# EAGLE design dc-servo-controller (EAGLE 5.10)
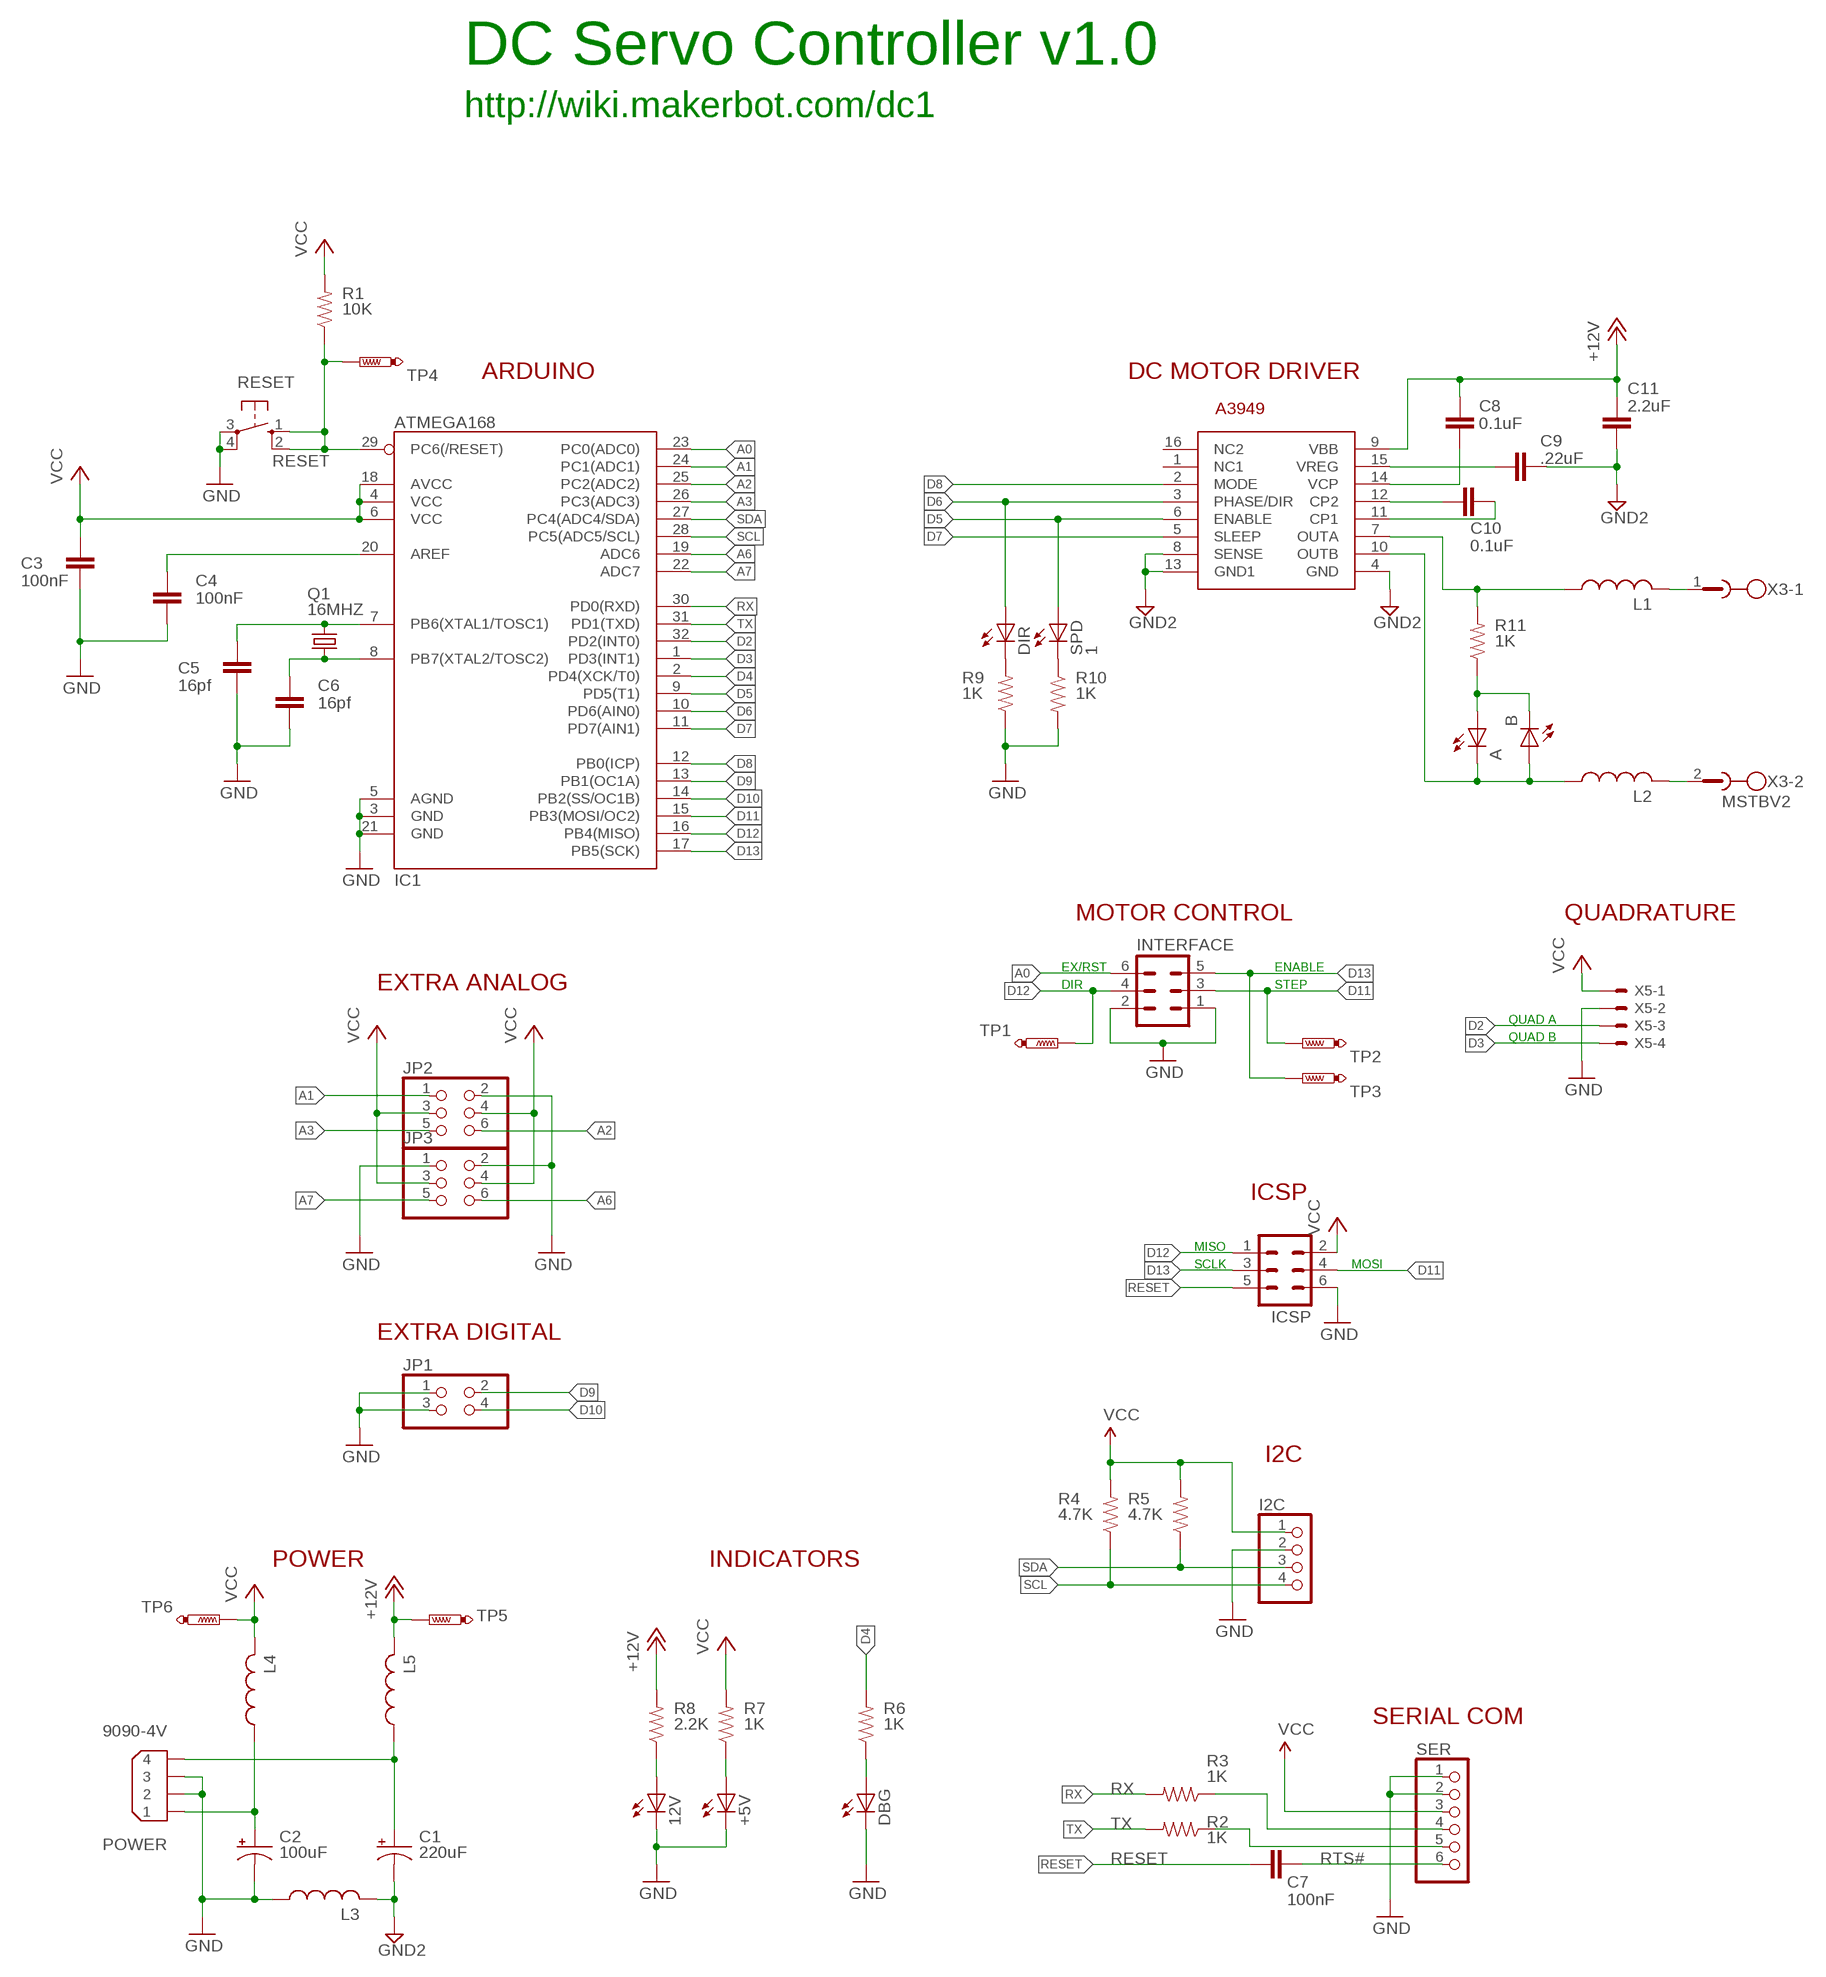
[diagram p0: schematic, sheet 1]

## Parts
12V  LED0805  [LED-0805]
+5V  LED0805  [LED-0805]
A  LED0805  [LED-0805]
B  LED0805  [LED-0805]
C1  220uF  CPOL-USE3.5-8  [E3,5-8]
C2  100uF  CPOL-USE3.5-8  [E3,5-8]
C3  100nF  CAP0805  [0805]
C4  100nF  CAP0805  [0805]
C5  16pf  CAP0805  [0805]
C6  16pf  CAP0805  [0805]
C7  100nF  CAP0805  [0805]
C8  0.1uF  CAP0805  [0805]
C9  .22uF  CAP0805  [0805]
C10  0.1uF  CAP0805  [0805]
C11  2.2uF  CAP0805  [0805]
DBG  LED0805  [LED-0805]
DIR  LED0805  [LED-0805]
I2C  PINHD-1X4  [1X04]
IC1  ATMEGA168  [TQFP32-08]
IC2  A3949  [SO16W]
ICSP  ML6  [ML6]
INTERFACE  ML6  [ML6]
JP1  PINHD-2X2  [2X02]
JP2  PINHD-2X3  [2X03]
JP3  PINHD-2X3  [2X03]
L1  L-USL2012C  [L2012C]
L2  L-USL2012C  [L2012C]
L3  L-USL2012C  [L2012C]
L4  L-USL2012C  [L2012C]
L5  L-USL2012C  [L2012C]
POWER  9090-4V  [9090-4V]
Q1  16MHZ  CRYSTALHC49S  [HC49/S]
R1  10K  RESISTOR  [0805]
R2  1K  RESISTOR  [0805]
R3  1K  RESISTOR  [0805]
R4  4.7K  RESISTOR  [0805]
R5  4.7K  RESISTOR  [0805]
R6  1K  RESISTOR  [0805]
R7  1K  RESISTOR  [0805]
R8  2.2K  RESISTOR  [0805]
R9  1K  RESISTOR  [0805]
R10  1K  RESISTOR  [0805]
R11  1K  RESISTOR  [0805]
RESET  10-XX  [B3F-10XX]
SER  PINHD-1X6  [1X06]
SPD  1  LED0805  [LED-0805]
TP1  PTR1TP09R  [TP09R]
TP2  PTR1TP09R  [TP09R]
TP3  PTR1TP09R  [TP09R]
TP4  PTR1TP09R  [TP09R]
TP5  PTR1TP09R  [TP09R]
TP6  PTR1TP09R  [TP09R]
X3  MSTBV2  [MSTBV2]
X5  C-GRID-04-70543  [70543-04]

## Nets
+12V [Power]: C8.2 C11.2 IC2.9(VBB) L5.2 R8.2 TP5.TP
A0: IC1.23(PC0(ADC0)) INTERFACE.6
A1: IC1.24(PC1(ADC1)) JP2.1
A2: IC1.25(PC2(ADC2)) JP2.6
A3: IC1.26(PC3(ADC3)) JP2.5
A6: IC1.19(ADC6) JP3.6
A7: IC1.22(ADC7) JP3.5
D2: IC1.32(PD2(INT0)) X5.3
D3: IC1.1(PD3(INT1)) X5.4
D4: IC1.2(PD4(XCK/T0)) R6.2
D5: IC1.9(PD5(T1)) IC2.6(ENABLE) SPD.A
D6: DIR.A IC1.10(PD6(AIN0)) IC2.3(PHASE/DIR)
D7: IC1.11(PD7(AIN1)) IC2.5(SLEEP)
D8: IC1.12(PB0(ICP)) IC2.2(MODE)
D9: IC1.13(PB1(OC1A)) JP1.2
D10: IC1.14(PB2(SS/OC1B)) JP1.4
D11: IC1.15(PB3(MOSI/OC2)) ICSP.4 INTERFACE.3 TP2.TP
D12: IC1.16(PB4(MISO)) ICSP.1 INTERFACE.4 TP1.TP
D13: IC1.17(PB5(SCK)) ICSP.3 INTERFACE.5 TP3.TP
GND [Power]: 12V.C +5V.C C2.- C3.1 C4.1 C5.1 C6.1 DBG.C I2C.2 IC1.3(GND) IC1.5(AGND) IC1.21(GND) ICSP.6 INTERFACE.1 INTERFACE.2 JP1.1 JP1.3 JP2.2 JP3.1 JP3.2 L3.1 POWER.2 POWER.3 R9.1 R10.2 RESET.3(P) RESET.4(P1) SER.1 SER.2 X5.2
GND2 [Power]: C1.- C9.1 C11.1 IC2.4(GND) IC2.8(SENSE) IC2.13(GND1) L3.2
N$1: L1.2 X3.1
N$2: +5V.A R7.1
N$3: L2.2 X3.2
N$4: C4.2 IC1.20(AREF)
N$5: R2.1 SER.5
N$6: C9.2 IC2.15(VREG)
N$7: C10.2 IC2.12(CP2)
N$8: R3.1 SER.4
N$9: C10.1 IC2.11(CP1)
N$10: C2.+ L4.1 POWER.1
N$11: DBG.A R6.1
N$12 [Power]: C1.+ L5.1 POWER.4
N$13: IC2.7(OUTA) L1.1 R11.2
N$14: A.C B.A IC2.10(OUTB) L2.1
N$15: A.A B.C R11.1
N$16: C8.1 IC2.14(VCP)
N$18: R10.1 SPD.C
N$23: DIR.C R9.2
N$26: 12V.A R8.1
N$31: C5.2 IC1.7(PB6(XTAL1/TOSC1)) Q1.2
N$32: C6.2 IC1.8(PB7(XTAL2/TOSC2)) Q1.1
RESET: C7.2 IC1.29(PC6(/RESET)) ICSP.5 R1.1 RESET.1(S) RESET.2(S1) TP4.TP
RTS#: C7.1 SER.6
RX: IC1.30(PD0(RXD)) R3.2
SCL: I2C.4 IC1.28(PC5(ADC5/SCL)) R4.1
SDA: I2C.3 IC1.27(PC4(ADC4/SDA)) R5.1
TX: IC1.31(PD1(TXD)) R2.2
VCC: C3.2 I2C.1 IC1.4(VCC) IC1.6(VCC) IC1.18(AVCC) ICSP.2 JP2.3 JP2.4 JP3.3 JP3.4 L4.2 R1.2 R4.2 R5.2 R7.2 SER.3 TP6.TP X5.1
Unconnected: IC2.1(NC1) IC2.16(NC2)

## Notes on the sheet
- DC Servo Controller v1.0
- http://wiki.makerbot.com/dc1
- ARDUINO | DC MOTOR DRIVER
- MOTOR CONTROL | QUADRATURE
- EX/RST | ENABLE
- EXTRA ANALOG | DIR | STEP
- QUAD A
- QUAD B
- ICSP
- MISO
- SCLK | MOSI
- EXTRA DIGITAL
- I2C
- POWER | INDICATORS
- SERIAL COM

## Library data of the parts
12V +5V A B DBG DIR SPD = SparkFun:LED: LEDs Standard schematic elements and footprints for 5mm, 3mm, 1206, and 0603 sized LEDs. 5mm - Spark Fun Electronics SKU : COM-00529 (and others)
C1 C2 = rcl:CPOL-US: POLARIZED CAPACITOR, American symbol
C3-C11 = SparkFun:CAP: Capacitor Standard 0603 ceramic capacitor, and 0.1" leaded capacitor.
I2C = pinhead:PINHD-1X4: PIN HEADER
IC1 = SparkFun:ATMEGA168
IC2 = reprap:A3949
ICSP = con-harting-ml:ML6: HARTING
INTERFACE = con-ml:ML6: HARTING
JP1 = pinhead:PINHD-2X2: PIN HEADER
JP2 JP3 = pinhead:PINHD-2X3: PIN HEADER
L1-L5 = rcl:L-US: INDUCTOR, American symbol
POWER = con-thomas-betts:9090-4: Disk Drive Power four position Source: Thomas & Betts Electronic Interconnects Eiropean Edition 1998
Q1 = crystal:CRYSTAL: CRYSTAL
R1-R11 = SparkFun:RESISTOR: Resistor Basic schematic elements and footprints for 0603, 1206, and PTH 1/10th watt (small) resistors.
RESET = switch-omron:10-XX: OMRON SWITCH
SER = pinhead:PINHD-1X6: PIN HEADER
TP1-TP6 = testpad:PTR1: TEST PIN
X3 = con-phoenix-508:MSTBV2: PHOENIX
X5 = reprap:C-GRID-04: CONNECTOR wire to board 2.54 mm (0.100") pitch header

## Net classes
0 default: width 0.305 mm
1 Power: width 0.305 mm
2 Trunk: width 1.676 mm, clearance 0.508 mm

## Board
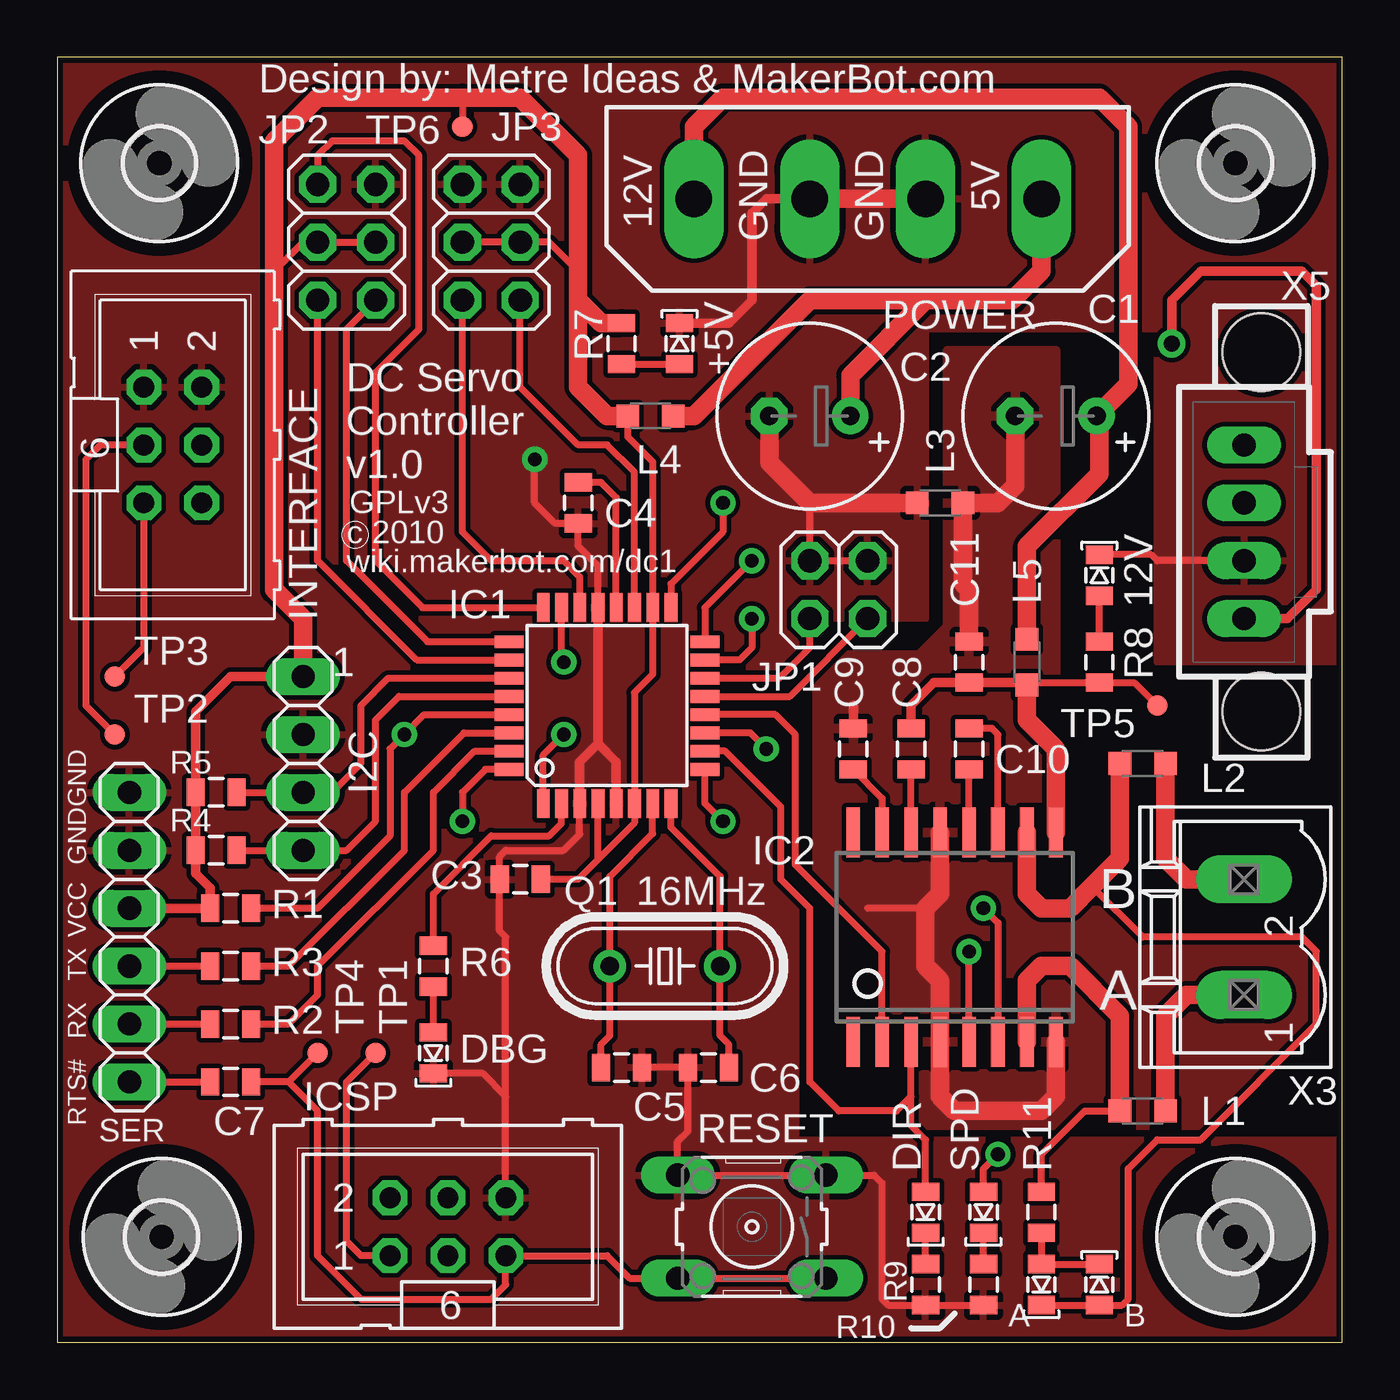
[diagram p1: board, top side]
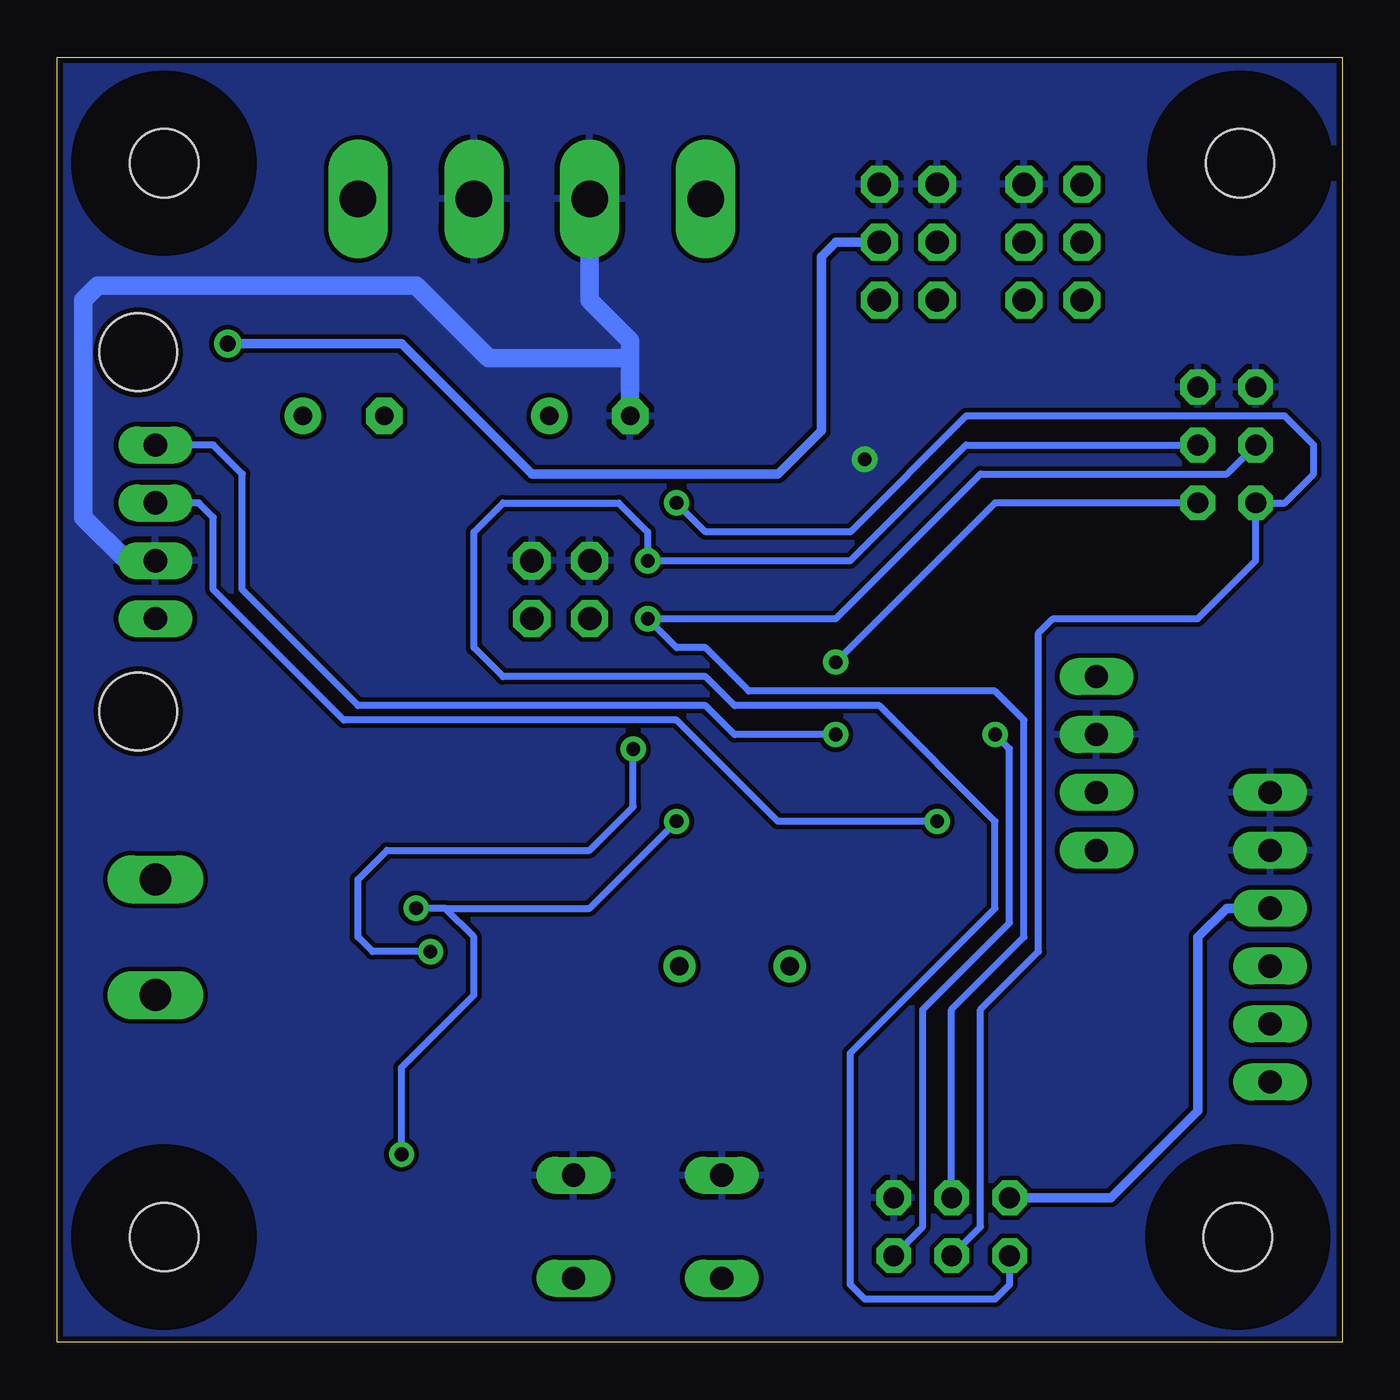
[diagram p2: board, bottom side, seen from below]

Size 56.39 x 56.39 mm. Coordinates in mm from the lower left corner, seen from the top.
Outline: 0,0 56.39,0 56.39,56.39 0,56.39 0,0
Copper layers (1*16): Top 0.035mm / dielectric 1.5mm / Bottom 0.035mm
Design rules "SparkFun *": minimum track width 8mil, minimum drill 20mil, track to track 8mil, track to pad 8mil, pad to pad 8mil, via to via 8mil, smd to smd 8mil, copper to edge 10mil, drill to drill 8mil, minimum pad ring 12mil, minimum via ring 10mil, stop-mask expansion 4mil, vias tented up to drill 25mil, thermal gap 10mil

### Footprints (pad centres in the part's own frame; a part is rotated, then mirrored left to right if it is on the bottom)
LED-0805 = smd 1.2 x 0.8: A 0,-0.9; C 0,0.9
E3,5-8 = drill 0.813 pad 1.6 round: + -1.778,0 | drill 0.813 pad 1.6 octagon: - 1.778,0
0805 = smd 0.8 x 1.2: 1 -0.9,0; 2 0.9,0
1X04 = drill 1.016 long: 1 -3.81,0; 2 -1.27,0; 3 1.27,0; 4 3.81,0
TQFP32-08 = smd 1.27 x 0.559: 1 -4.293,2.8; 2 -4.293,2; 3 -4.293,1.2; 4 -4.293,0.4; 5 -4.293,-0.4; 6 -4.293,-1.2; 7 -4.293,-2; 8 -4.293,-2.8; 17 4.293,-2.8; 18 4.293,-2; 19 4.293,-1.2; 20 4.293,-0.4; 21 4.293,0.4; 22 4.293,1.2; 23 4.293,2; 24 4.293,2.8 | smd 0.559 x 1.27: 9 -2.8,-4.293; 10 -2,-4.293; 11 -1.2,-4.293; 12 -0.4,-4.293; 13 0.4,-4.293; 14 1.2,-4.293; 15 2,-4.293; 16 2.8,-4.293; 25 2.8,4.293; 26 2,4.293; 27 1.2,4.293; 28 0.4,4.293; 29 -0.4,4.293; 30 -1.2,4.293; 31 -2,4.293; 32 -2.8,4.293
SO16W = smd 0.6 x 2.2: 1 -4.445,-4.6; 2 -3.175,-4.6; 3 -1.905,-4.6; 4 -0.635,-4.6; 5 0.635,-4.6; 6 1.905,-4.6; 7 3.175,-4.6; 8 4.445,-4.6; 9 4.445,4.6; 10 3.175,4.6; 11 1.905,4.6; 12 0.635,4.6; 13 -0.635,4.6; 14 -1.905,4.6; 15 -3.175,4.6; 16 -4.445,4.6
ML6 = drill 0.914 octagon: 1 -2.54,-1.27; 2 -2.54,1.27; 3 0,-1.27; 4 0,1.27; 5 2.54,-1.27; 6 2.54,1.27
2X02 = drill 1.016 octagon: 1 -1.27,-1.27; 2 -1.27,1.27; 3 1.27,-1.27; 4 1.27,1.27
2X03 = drill 1.016 octagon: 1 -2.54,-1.27; 2 -2.54,1.27; 3 0,-1.27; 4 0,1.27; 5 2.54,-1.27; 6 2.54,1.27
L2012C = smd 1 x 1: 1 -1,0; 2 1,0
9090-4V = drill 1.6 pad 2.6 long: 1 -7.62,0; 2 -2.54,0; 3 2.54,0; 4 7.62,0
HC49/S = drill 0.813 round: 1 -2.413,0; 2 2.413,0
B3F-10XX = drill 1.016 long: 1 -3.251,2.261; 2 3.251,2.261; 3 -3.251,-2.261; 4 3.251,-2.261
1X06 = drill 1.016 long: 1 -6.35,0; 2 -3.81,0; 3 -1.27,0; 4 1.27,0; 5 3.81,0; 6 6.35,0
TP09R = smd 0.9 x 0.9: TP 0,0
3,0 = hole 3: 0,0
MSTBV2 = drill 1.397 long: 1 -2.54,0; 2 2.54,0
70543-04 = drill 1.016 long: 1 -3.81,0; 2 -1.27,0; 3 1.27,0; 4 3.81,0 | hole 3.404: -7.874,-0.762; 7.874,-0.762

### Placement (x,y rotation side)
12V  45.72,33.66 0 top
+5V  27.3,43.81 0 top
A  43.18,2.54 180 top
B  45.72,2.54 0 top
C1  43.81,40.64 180 top
C2  33.02,40.64 180 top
C3  20.32,20.32 0 top
C4  22.86,36.83 90 top
C5  24.77,12.06 180 top
C6  28.57,12.06 0 top
C7  7.62,11.43 0 top
C8  37.47,26.04 90 top
C9  34.92,26.04 270 top
C10  40.01,26.04 270 top
C11  40.01,29.84 270 top
DBG  16.51,12.7 180 top
DIR  38.1,5.71 180 top
I2C  10.79,25.4 270 top
IC1  24.13,27.94 90 top
IC2  39.37,17.78 0 top
ICSP  17.14,5.08 0 top
INTERFACE  5.08,39.37 270 top
JP1  34.29,33.02 180 top
JP2  12.7,48.26 270 top
JP3  19.05,48.26 270 top
L1  47.62,10.16 0 top
L2  47.62,25.4 0 top
L3  38.73,36.83 0 top
L4  26.04,40.64 180 top
L5  42.55,29.84 270 top
POWER  35.56,50.16 180 top
Q1  26.67,16.51 180 top
R1  7.62,19.05 180 top
R2  7.62,13.97 0 top
R3  7.62,16.51 0 top
R4  6.99,21.59 180 top
R5  6.99,24.13 180 top
R6  16.51,16.51 90 top
R7  24.77,43.81 90 top
R8  45.72,29.84 270 top
R9  38.1,2.54 90 top
R10  40.64,2.54 270 top
R11  43.18,5.71 90 top
RESET  30.48,5.08 180 top
SER  3.17,17.78 270 top
SPD  40.64,5.71 180 top
TP1  13.97,12.7 0 top
TP2  2.54,26.67 0 top
TP3  2.54,29.21 0 top
TP4  11.43,12.7 0 top
TP5  48.26,27.94 0 top
TP6  17.78,53.34 0 top
U$1  [3,0]  4.49,51.73 0 top
U$2  [3,0]  51.69,51.73 0 top
U$3  [3,0]  4.59,4.63 0 top
U$4  [3,0]  51.69,4.63 0 top
X3  52.07,17.78 90 top
X5  52.07,35.56 90 top

### Tracks (layer width: path | path; a pad name or v marks a point on that pad's centre or on a via)
+12V
  Top 0.305: L5.2 42.65,28.95 R8.2 47.26,28.95 TP5.TP
  Top 0.406: C8.2 37.47,27.94 38.47,28.95 C11.2 42.45,28.95 L5.2
  Top 0.813: IC2.9 43.81,26.04 42.55,27.3 L5.2
A0  (via drill 0.6)
  Top 0.305: IC1.23 22.13,29.94 v22.23,29.84
  Bottom 0.305: INTERFACE.6 15.24,36.83 v22.23,29.84
A1
  Top 0.305: IC1.24 16.03,32.23 13.97,34.29 13.97,42.55 15.88,44.45 15.88,52.07 15.24,52.7 12.06,52.7 11.43,52.07 JP2.1
A2
  Top 0.305: JP2.6 12.7,44.45 12.7,34.29 16.25,30.74 IC1.25
A3
  Top 0.305: JP2.5 11.43,34.29 15.78,29.94 IC1.26
A6
  Top 0.305: IC1.19 25.33,38.17 24.13,39.37 22.86,39.37 20.32,41.91 JP3.6
A7
  Top 0.305: IC1.22 22.93,33.59 22.23,34.29 19.05,34.29 17.78,35.56 JP3.5
D2  (via drill 0.6)
  Top 0.305: IC1.32 18.79,25.14 17.78,24.13 v17.78,22.86
  Bottom 0.305: X5.3 50.16,36.83 49.53,36.2 49.53,33.02 43.81,27.3 29.21,27.3 24.77,22.86 v17.78,22.86
D3  (via drill 0.6)
  Top 0.305: IC1.1 21.33,25.77 v22.23,26.67
  Bottom 0.305: X5.4 49.53,39.37 48.26,38.1 48.26,33.02 43.18,27.94 27.94,27.94 26.67,26.67 v22.23,26.67
D4
  Top 0.305: IC1.2 22.13,22.77 21.59,22.23 19.05,22.23 16.51,19.68 R6.2
D5  (via drill 0.6)
  Top 0.305: IC2.6 41.27,18.41 v40.64,19.05 | IC1.9 28.42,23.65 v29.21,22.86 | SPD.A 40.64,7.62 v41.27,8.26
  Bottom 0.305: v29.21,22.86 33.02,19.05 39.37,19.05 | 39.37,19.05 v40.64,19.05 | v41.27,8.26 41.27,12.06 38.1,15.24 38.1,17.78 39.37,19.05
D6
  Top 0.305: 37.47,10.79 IC2.3 | 37.47,10.79 36.83,10.16 34.29,10.16 33.02,11.43 33.02,19.05 31.75,20.32 31.75,23.5 29.3,25.94 IC1.10 | 37.47,10.79 37.47,9.53 38.1,8.89 DIR.A
D7  (via drill 0.6)
  Top 0.305: IC2.5 v40.01,17.14 | IC1.11 30.41,26.74 v31.11,26.04
  Bottom 0.305: v31.11,26.04 31.11,23.5 33.02,21.59 41.91,21.59 43.18,20.32 43.18,17.78 42.55,17.14 v40.01,17.14
D8
  Top 0.305: IC1.12 31.52,27.54 32.38,26.67 32.38,20.95 36.2,17.14 IC2.2
D9
  Top 0.305: IC1.13 32.15,28.34 JP1.2
D10
  Top 0.305: IC1.14 31.68,29.14 33.02,30.48 JP1.4
D11  (via drill 0.6)
  Top 0.305: IC1.15 29.94,29.94 30.48,30.48 v30.48,31.75 | TP2.TP 1.27,27.94 1.27,38.73 1.91,39.37 INTERFACE.3
  Bottom 0.305: INTERFACE.3 5.08,38.1 15.88,38.1 22.23,31.75 v30.48,31.75 29.21,30.48 27.94,30.48 26.04,28.57 15.24,28.57 13.97,27.3 13.97,17.78 17.14,14.61 ICSP.4
D12  (via drill 0.6)
  Top 0.305: IC1.16 28.42,32.23 v30.48,34.29 | TP1.TP 12.7,11.43 12.7,4.45 13.34,3.81 ICSP.1
  Bottom 0.305: ICSP.1 14.61,2.54 15.24,1.91 20.95,1.91 21.59,2.54 21.59,12.7 15.24,19.05 15.24,22.86 20.32,27.94 26.67,27.94 27.94,29.21 36.83,29.21 38.1,30.48 38.1,35.56 36.83,36.83 31.75,36.83 30.48,35.56 v30.48,34.29 21.59,34.29 16.51,39.37 INTERFACE.4
D13  (via drill 0.6)
  Top 0.305: IC1.17 26.93,33.28 29.21,35.56 v29.21,36.83 | TP3.TP 3.81,30.48 INTERFACE.5
  Bottom 0.305: ICSP.3 15.88,5.08 15.88,14.61 13.34,17.14 13.34,31.11 12.7,31.75 6.35,31.75 3.81,34.29 INTERFACE.5 2.54,36.83 1.27,38.1 1.27,39.37 2.54,40.64 16.51,40.64 21.59,35.56 27.94,35.56 v29.21,36.83
GND  (via drill 0.6)
  Top 0.305: IC1.3 22.93,22.3 22.23,21.59 19.68,21.59 19.42,21.32 C3.1 19.42,18.05 19.68,17.78 19.68,10.79 | R10.2 R9.1 36.46,1.64 36.2,1.91 36.2,6.99 35.84,7.34 RESET.3 RESET.4 27.23,8.81 27.68,9.26 C6.1 C5.1 | 12V.C 47.99,34.55 48.26,34.29 X5.2 | IC1.21 23.73,34.05 22.86,34.92 C4.1 21.86,35.93 20.95,36.83 v20.95,38.73 | ICSP.6 19.68,10.79 | DBG.C 18.68,11.8 19.68,10.79 | JP1.1 JP1.3 33.02,36.83
  Top 0.406: +5V.C 29.48,44.72 30.48,45.72 30.48,49.53 31.11,50.16 POWER.3 | 23.73,26.27 IC1.21 | IC1.3 22.93,25.47 23.73,26.27 | IC1.5 24.53,25.47 23.73,26.27
  Top 0.813: POWER.3 POWER.2 | C2.- 31.24,38.61 33.02,36.83 L3.1
  Bottom 0.813: POWER.3 33.02,45.72 31.24,43.94 31.24,43.18 | C2.- 31.24,43.18 | X5.2 53.34,34.29 55.24,36.2 55.24,45.72 54.61,46.35 40.64,46.35 37.47,43.18 31.24,43.18
  pour Bottom: 0,0 0,56.52 56.52,56.52 56.52,0
  pour Top: 0,0 0,56.52 56.52,56.52 56.52,29.84 48.26,29.84 48.26,44.45 38.1,44.45 38.1,31.75 32.38,31.75 32.38,9.53 32.38,8.89 56.52,8.89 56.52,0
GND2
  Top 0.305: 38.1,19.05 35.56,19.05
  Top 0.406: C9.1 34.92,27.94
  Top 0.813: IC2.8 43.81,10.79 43.18,10.16 39.37,10.16 38.73,10.79 IC2.4 38.73,15.88 38.1,16.51 38.1,19.05 38.73,19.68 IC2.13 | C1.- 42.04,37.59 41.27,36.83 L3.2 39.73,33.29 40.01,33.02 C11.1
  pour Top: 56.2,9.53 33.34,9.53 33.34,30.16 37.78,30.16 39.05,31.43 39.05,43.5 43.81,43.5 43.81,27.62 46.99,27.62 46.99,26.99 56.2,26.99
N$1
  Top 0.813: X3.1 49.53,15.24 48.62,14.34 L1.2
N$2
  Top 0.305: R7.1 +5V.A
N$3
  Top 0.813: X3.2 49.53,20.32 48.62,21.23 L2.2
N$4
  Top 0.305: C4.2 23.86,37.73 24.53,37.06 IC1.20
N$5
  Top 0.305: SER.5 R2.1
N$6
  Top 0.305: IC2.15 36.2,23.86 C9.2
N$7
  Top 0.305: IC2.12 C10.2
N$8
  Top 0.305: SER.4 R3.1
N$9
  Top 0.305: IC2.11 41.27,26.67 41.01,26.93 C10.1
N$10
  Top 0.813: C2.+ 34.8,42.42 38.1,45.72 | POWER.1 43.18,46.99 41.91,45.72 38.1,45.72 | L4.1 27.94,40.64 33.02,45.72 38.1,45.72
N$11
  Top 0.305: DBG.A R6.1
N$12
  Top 0.813: POWER.4 27.94,53.34 29.21,54.61 45.72,54.61 46.99,53.34 46.99,42.04 C1.+ 45.72,40.51 45.72,38.1 42.55,34.92 L5.1
N$13
  Top 0.305: L1.1 45.09,10.16 43.18,8.26 R11.2
  Top 0.813: IC2.7 42.55,15.88 43.18,16.51 44.45,16.51 46.62,14.34 L1.1
N$14
  Top 0.305: 45.4,20 47.62,17.78 54.61,17.78 55.24,17.14 55.24,13.97 50.16,8.89 48.26,8.89 46.99,7.62 46.99,1.91 46.73,1.64 B.A A.C
  Top 0.813: IC2.10 42.55,19.68 43.18,19.05 44.45,19.05 45.4,20 46.62,21.23 L2.1
N$15
  Top 0.305: B.C A.A R11.1
N$16
  Top 0.305: IC2.14 C8.1
N$18
  Top 0.305: R10.1 SPD.C
N$23
  Top 0.305: R9.2 DIR.C
N$26
  Top 0.305: R8.1 12V.A
N$31
  Top 0.305: IC1.7 26.13,22.32 24.26,20.45 Q1.2 24.26,13.46 23.86,13.07 C5.2
N$32
  Top 0.305: IC1.8 26.93,22.6 29.08,20.45 Q1.1 29.08,13.46 29.48,13.07 C6.2
RESET  (via drill 0.6)
  Top 0.305: 10.16,11.43 11.43,10.16 11.43,3.81 13.34,1.91 19.05,1.91 19.68,2.54 ICSP.5 24.13,3.81 25.12,2.82 RESET.2 RESET.1 | 10.16,11.43 C7.2 | IC1.29 16.11,27.54 v15.24,26.67 14.61,26.04 14.61,22.23 11.43,19.05 R1.1 | 10.16,11.43 TP4.TP
  Bottom 0.305: v15.24,26.67 14.61,26.04 14.61,18.41 18.41,14.61 18.41,5.08 ICSP.5
RTS#
  Top 0.305: SER.6 C7.1
RX
  Top 0.305: IC1.30 17.85,26.74 15.24,24.13 15.24,21.59 10.16,16.51 R3.2
SCL
  Top 0.305: R4.1 I2C.4 12.7,21.59 13.97,22.86 13.97,27.3 15.01,28.34 IC1.28
SDA
  Top 0.305: R5.1 I2C.3 12.06,24.13 13.34,25.4 13.34,27.94 14.54,29.14 IC1.27
TX
  Top 0.305: IC1.31 18.32,25.94 16.51,24.13 16.51,21.59 11.43,16.51 11.43,15.24 10.16,13.97 R2.2
VCC  (via drill 0.7)
  Top 0.305: JP3.3 JP3.4 21.59,48.26 22.86,46.99 | L4.2 25.04,39.73 26.13,38.64 IC1.18 26.13,29.3 25.33,28.5 IC1.6 25.33,22.79 23.73,21.19 | 9.53,46.99 10.79,48.26 JP2.3 JP2.4 | 17.78,54.61 TP6.TP | C3.2 22.86,20.32 23.73,21.19 | 23.73,21.19 IC1.4
  Top 0.406: SER.3 R1.2 6.72,19.95 6.08,20.59 R4.2 R5.2 6.08,27.68 7.62,29.21 I2C.1 | X5.1 53.98,31.75 55.24,33.02 55.24,46.35 54.61,46.99 50.16,46.99 48.9,45.72 v48.9,43.81
  Top 0.813: R7.2 23.86,44.72 22.86,45.72 | 22.86,45.72 22.86,46.99 22.86,52.07 20.32,54.61 17.78,54.61 11.43,54.61 9.53,52.7 9.53,46.99 9.53,33.02 10.79,31.75 I2C.1 | L4.2 24.13,40.64 22.86,41.91 22.86,45.72
  Bottom 0.406: v48.9,43.81 41.27,43.81 35.56,38.1 24.77,38.1 22.86,40.01 22.86,47.62 22.23,48.26 JP3.4 | ICSP.2 10.16,6.35 6.35,10.16 6.35,17.78 5.08,19.05 SER.3

### Text on the board
tPlace: Design by: Metre Ideas & MakerBot.com | 12V | GND | GND | 5V | DC Servo | Controller | v1.0 | GPLv3 | c 2010 | wiki.makerbot.com/dc1 | GND | GND | 16MHz | B | VCC | TX | A | RX | RTS#
tNames: 1